# EAGLE schematic tube-connector (EAGLE 7.2.0)
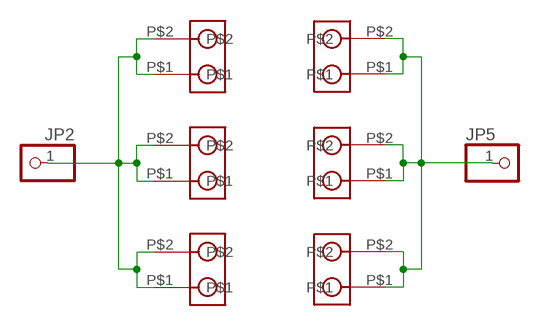
[diagram p0: schematic, sheet 1]

## Parts
JP2  PINHD-1X1  [1X01]
JP5  PINHD-1X1  [1X01]
U$1  GM-CONNECTOR  [GM-CONNECTOR]
U$2  GM-CONNECTOR  [GM-CONNECTOR]
U$3  GM-CONNECTOR  [GM-CONNECTOR]
U$4  GM-CONNECTOR  [GM-CONNECTOR]
U$5  GM-CONNECTOR  [GM-CONNECTOR]
U$6  GM-CONNECTOR  [GM-CONNECTOR]

## Nets
N$3: JP2.1 U$1.P$1 U$1.P$2 U$2.P$1 U$2.P$2 U$3.P$1 U$3.P$2
N$4: JP5.1 U$4.P$1 U$4.P$2 U$5.P$1 U$5.P$2 U$6.P$1 U$6.P$2

## Library data of the parts
JP2 JP5 = pinhead:PINHD-1X1: PIN HEADER
U$1-U$6 = gm-con:GM-CONNECTOR: GM connectors for STS-5 Geiger-Muler tube.